# EAGLE schematic hydrogen_sensors_board_v2 (EAGLE 8.4.1)
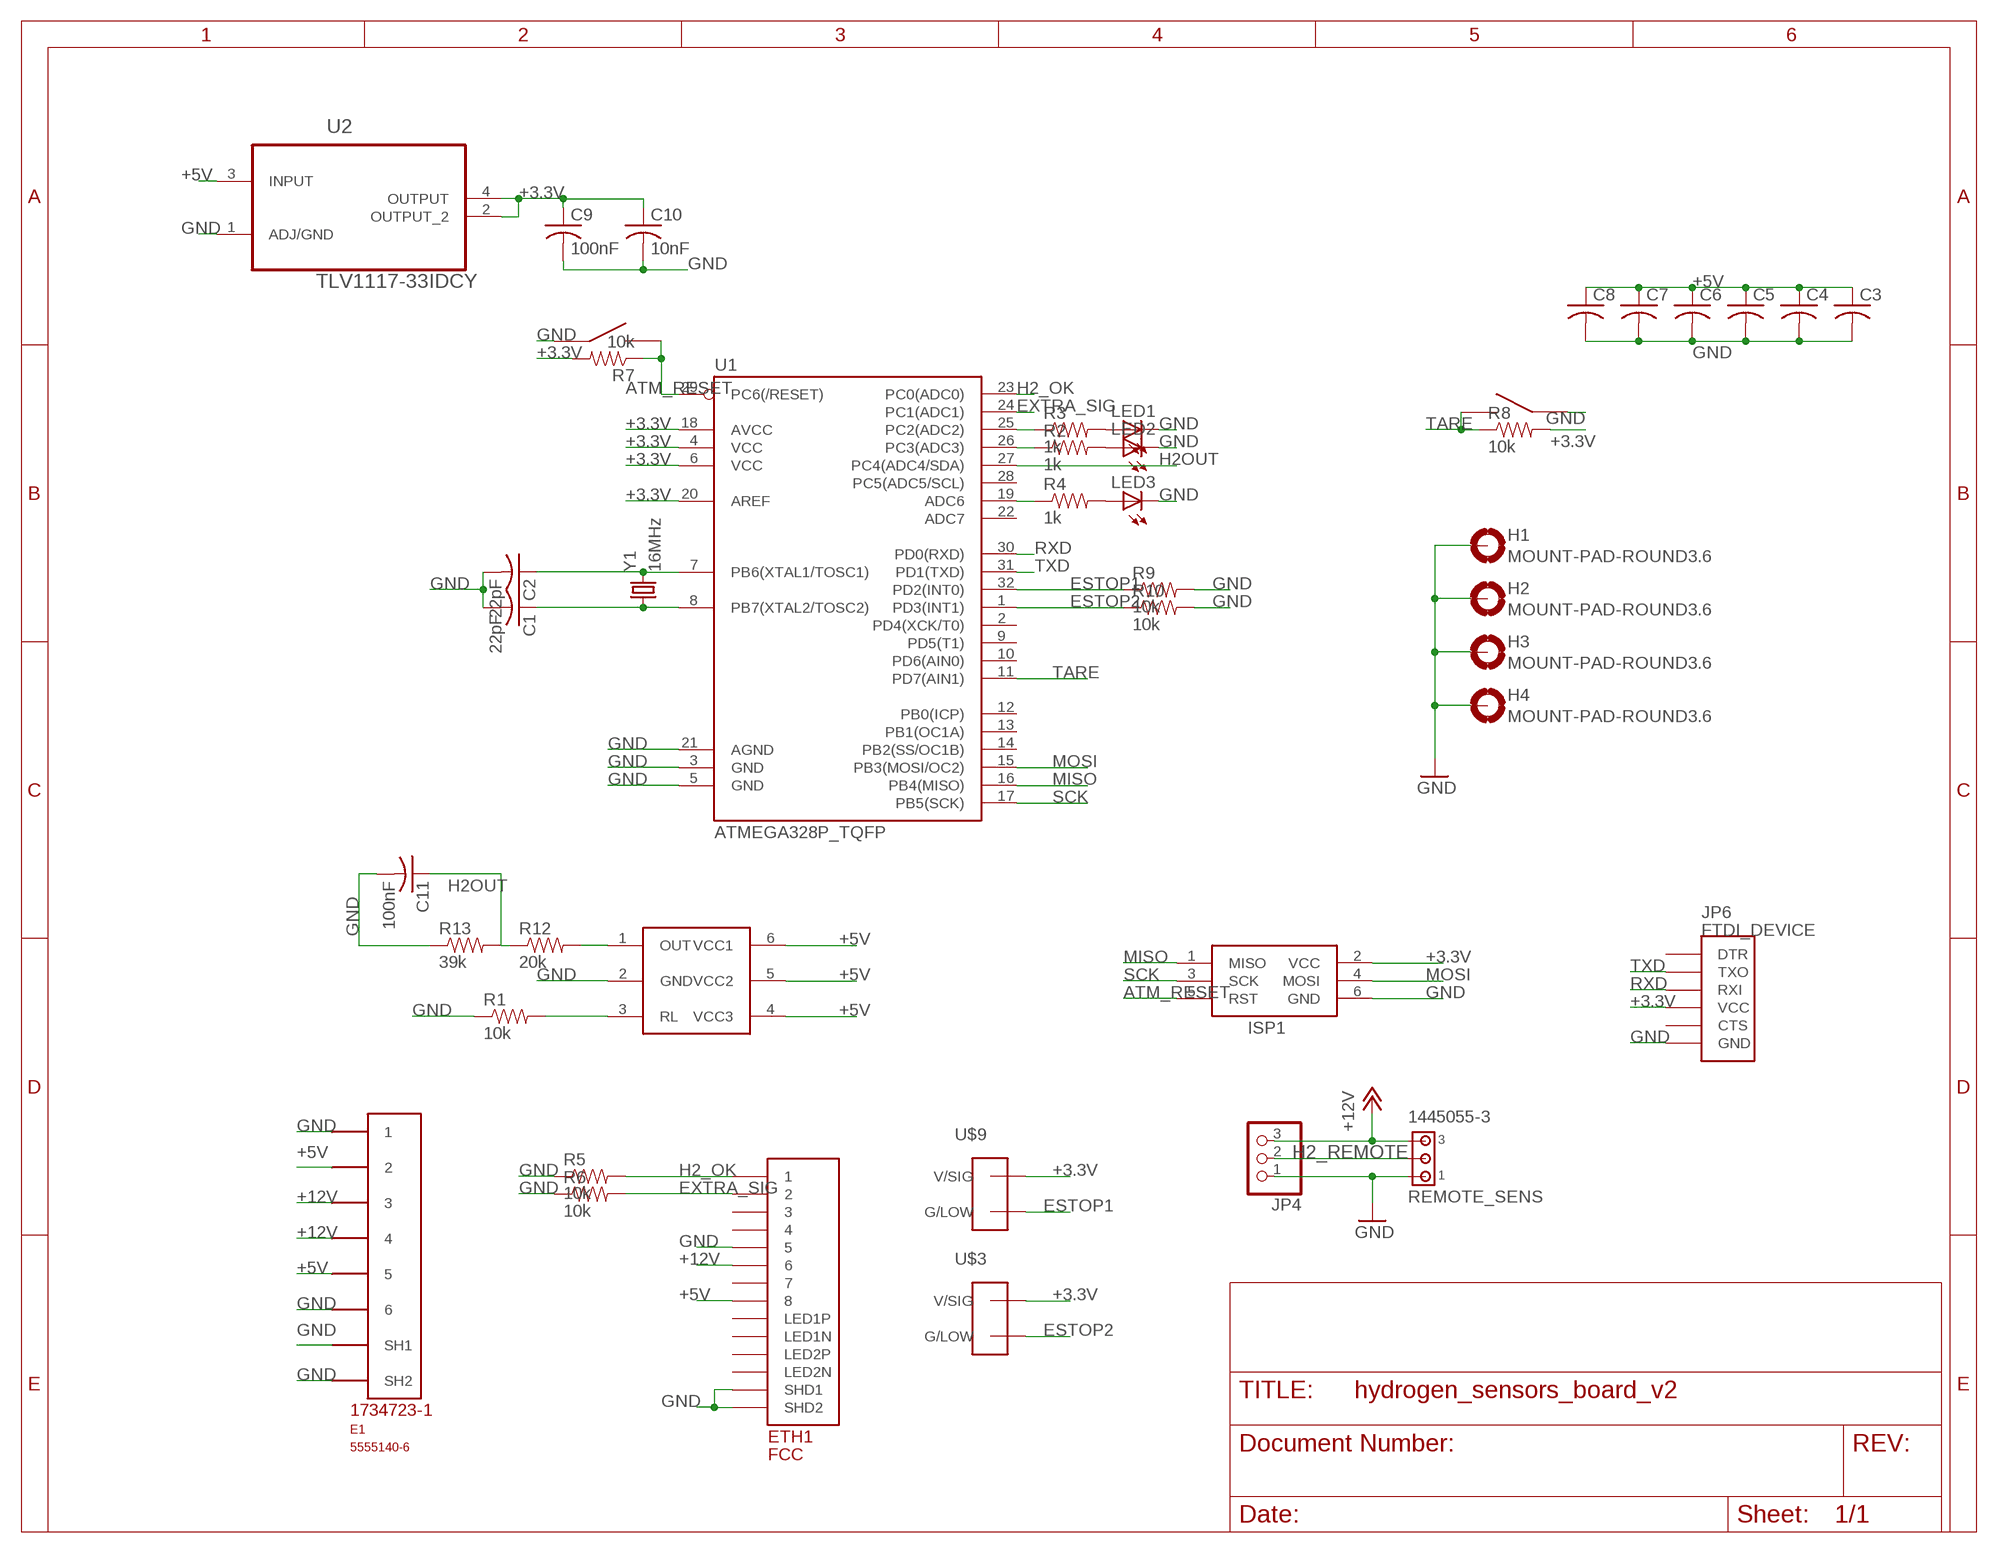
[diagram p0: schematic, sheet 1]

## Parts
C1  22pF  C-USC0603K  [C0603K]
C2  22pF  C-USC0603K  [C0603K]
C3  C-USC0603  [C0603]
C4  C-USC0603  [C0603]
C5  C-USC0603  [C0603]
C6  C-USC0603  [C0603]
C7  C-USC0603  [C0603]
C8  C-USC0603  [C0603]
C9  100nF  C-USC0603  [C0603]
C10  10nF  C-USC0603  [C0603]
C11  100nF  C-USC0603  [C0603]
E1  5555140-6  [1734723-1_RJ11]
ETH1  FCC  ETHERNET  [A122645-ND]
H1  MOUNT-PAD-ROUND3.6  [3,6-PAD]
H2  MOUNT-PAD-ROUND3.6  [3,6-PAD]
H3  MOUNT-PAD-ROUND3.6  [3,6-PAD]
H4  MOUNT-PAD-ROUND3.6  [3,6-PAD]
ISP1  AVRISP-BOX  [AVRISP-BOX]
JP4  PINHD-1X3  [1X03]
JP6  FTDI_DEVICE  [FTDI_DEVICE_SIDE]
LED1  LEDCHIPLED_0805  [CHIPLED_0805]
LED2  LEDCHIPLED_0805  [CHIPLED_0805]
LED3  LEDCHIPLED_0805  [CHIPLED_0805]
R1  10k  RESISTOR0603-RES  [0603-RES]
R2  1k  RESISTOR0603-RES  [0603-RES]
R3  1k  RESISTOR0603-RES  [0603-RES]
R4  1k  RESISTOR0603-RES  [0603-RES]
R5  10k  RESISTOR0603-RES  [0603-RES]
R6  10k  RESISTOR0603-RES  [0603-RES]
R7  10k  RESISTOR0603-RES  [0603-RES]
R8  10k  RESISTOR0603-RES  [0603-RES]
R9  10k  RESISTOR0603-RES  [0603-RES]
R10  10k  RESISTOR0603-RES  [0603-RES]
R12  20k  RESISTOR0603-RES  [0603-RES]
R13  39k  RESISTOR0603-RES  [0603-RES]
REMOTE_SENS  1445055-3  [1445055-3]
U1  ATMEGA328P_TQFP  [TQFP32-08]
U2  TLV1117-33IDCY  [SOT230P700X180-4N]
U$1  MQ-8MQ-8  [MQ-8]
U$2  EG4621CT-ND  [EG4621CT-ND]
U$3  TE770966  [2X1-MATE-N-LOCK]
U$9  TE770966  [2X1-MATE-N-LOCK]
U$10  EG4621CT-ND  [EG4621CT-ND]
Y1  16MHz  CRYSTALHC49US  [HC49US]

## Nets
+3.3V: C9.1 C10.1 ISP1.2(VCC) JP6.P$4(VCC) R7.2 R8.2 U1.4(VCC) U1.6(VCC) U1.18(AVCC) U1.20(AREF) U2.2(OUTPUT_2) U2.4(OUTPUT) U$3.CIRCUIT1(V/SIG) U$9.CIRCUIT1(V/SIG)
+5V: C3.1 C4.1 C5.1 C6.1 C7.1 C8.1 E1.2 E1.5 ETH1.P$8 U2.3(INPUT) U$1.4(VCC3) U$1.5(VCC2) U$1.6(VCC1)
+12V: E1.3 E1.4 ETH1.P$6 JP4.3 REMOTE_SENS.3
ATM_RESET: ISP1.5(RST) R7.1 U1.29(PC6(/RESET)) U$10.P$3 U$10.P$4
ESTOP1: R9.1 U1.32(PD2(INT0)) U$9.CIRCUIT2(G/LOW)
ESTOP2: R10.1 U1.1(PD3(INT1)) U$3.CIRCUIT2(G/LOW)
EXTRA_SIG: ETH1.P$2 R6.2 U1.24(PC1(ADC1))
GND: C1.2 C2.2 C3.2 C4.2 C5.2 C6.2 C7.2 C8.2 C9.2 C10.2 C11.2 E1.1 E1.6 E1.SH1 E1.SH2 ETH1.P$5 ETH1.P$13(SHD1) ETH1.P$14(SHD2) H1.B3,6(MOUNT) H2.B3,6(MOUNT) H3.B3,6(MOUNT) H4.B3,6(MOUNT) ISP1.6(GND) JP4.1 JP6.P$6(GND) LED1.C LED2.C LED3.C R1.1 R5.1 R6.1 R9.2 R10.2 R13.1 REMOTE_SENS.1 U1.3(GND) U1.5(GND) U1.21(AGND) U2.1(ADJ/GND) U$1.2(GND) U$2.P$1 U$2.P$2 U$10.P$1 U$10.P$2
H2_OK: ETH1.P$1 R5.2 U1.23(PC0(ADC0))
H2_REMOTE: JP4.2 REMOTE_SENS.2
H2OUT: C11.1 R12.1 R13.2 U1.27(PC4(ADC4/SDA))
MISO: ISP1.1(MISO) U1.16(PB4(MISO))
MOSI: ISP1.4(MOSI) U1.15(PB3(MOSI/OC2))
N$1: C2.1 U1.7(PB6(XTAL1/TOSC1)) Y1.2
N$2: R1.2 U$1.3(RL)
N$3: C1.1 U1.8(PB7(XTAL2/TOSC2)) Y1.1
N$4: R3.1 U1.25(PC2(ADC2))
N$5: R2.1 U1.26(PC3(ADC3))
N$6: R4.1 U1.19(ADC6)
N$7: LED1.A R3.2
N$8: LED2.A R2.2
N$9: LED3.A R4.2
N$10: R12.2 U$1.1(OUT)
RXD: JP6.P$3(RXI) U1.30(PD0(RXD))
SCK: ISP1.3(SCK) U1.17(PB5(SCK))
TARE: R8.1 U1.11(PD7(AIN1)) U$2.P$3 U$2.P$4
TXD: JP6.P$2(TXO) U1.31(PD1(TXD))
Unconnected: ETH1.P$3 ETH1.P$4 ETH1.P$7 ETH1.P$9(LED1N) ETH1.P$10(LED1P) ETH1.P$11(LED2N) ETH1.P$12(LED2P) JP6.P$1(DTR) JP6.P$5(CTS) U1.2(PD4(XCK/T0)) U1.9(PD5(T1)) U1.10(PD6(AIN0)) U1.12(PB0(ICP)) U1.13(PB1(OC1A)) U1.14(PB2(SS/OC1B)) U1.22(ADC7) U1.28(PC5(ADC5/SCL))

## Library data of the parts
C1-C11 = adafruit:C-US: CAPACITOR, American symbol
E1 = 5555140-6 RJ11:5555140-6
ETH1 = ETHERNET:ETHERNET: Ethernet port with 2 leds. digikey number A122645-ND
H1-H4 = holes:MOUNT-PAD-ROUND: MOUNTING PAD, round
ISP1 = adafruit:AVRISP: AVR ISP HEADER Standard 6 pin header for AVR programming
JP4 = pinhead:PINHD-1X3: PIN HEADER
JP6 = SparkFun-Connectors:FTDI_DEVICE: Connector which mates to FTDI basic or FTDI cable.
LED1-LED3 = adafruit:LED: LED OSRAM: - CHIPLED LG R971, LG N971, LY N971, LG Q971, LY Q971, LO R971, LY R971 LH N974, LH R974 LS Q976, LO Q976, LY Q976 LO Q996 - Hyper CHIPLED LW Q18S LB Q993, LB Q99A, LB R99A - SideLED LS A670, LO A670, LY A670, LG A670, LP A670 LB A673, LV A673, LT A673, LW A673 LH A674 LY A675 LS A676, LA A676, LO A676, LY A676, LW A676 LS A679, LY A679, LG A679 - Hyper Micro SIDELED® LS Y876, LA Y876, LO Y876, LY Y876 LT Y87S - SmartLED LW L88C, LW L88S LB L89C, LB L89S, LG L890 LS L89K, LO L89K, LY L89K LS L896, LA L896, LO L896, LY L896 - TOPLED LS T670, LO T670, LY T670, LG T670, LP T670 LSG T670, LSP T670, LSY T670, LOP T670, LYG T670 LG T671, LOG T671, LSG T671 LB T673, LV T673, LT T673, LW T673 LH T674 LS T676, LA T676, LO T676, LY T676, LB T676, LH T676, LSB T676, LW T676 LB T67C, LV T67C, LT T67C, LS T67K, LO T67K, LY T67K, LW E67C LS E67B, LA E67B, LO E67B, LY E67B, LB E67C, LV E67C, LT E67C LW T67C LS T679, LY T679, LG T679 LS T770, LO T770, LY T770, LG T770, LP T770 LB T773, LV T773, LT T773, LW T773 LH T774 LS E675, LA E675, LY E675, LS T675 LS T776, LA T776, LO T776, LY T776, LB T776 LHGB T686 LT T68C, LB T68C - Hyper Mini TOPLED® LB M676 - Mini TOPLED Santana® LG M470 LS M47K, LO M47K, LY M47K Source: http://www.osram.convergy.de/
R1 R5 R6 R9 R10 R12 R13 = SparkFun-Passives:RESISTOR: Resistor Basic schematic elements and footprints for 0603, 1206, and PTH resistors.
R2-R4 R7 R8 = SparkFun-Resistors:RESISTOR: Resistor Basic schematic elements and footprints for 0603, 1206, and PTH resistors.
REMOTE_SENS = con-amp:1445055-3: Micro MATE-N-LOK Connectors grid 1.5 mm Source: ENG_CD_1445055_A.pdf
U1 = SparkFun-DigitalIC:ATMEGA328P_TQFP; PROD_ID: IC-09069
U2 = Texas Instruments_By_element14_Batch_1:TLV1117-33IDCY: V REG, LDO, 3.3V, 0.8A; MPN: TLV1117-33IDCY; OC_FARNELL: 1703385; OC_NEWARK: 67K8522; PACKAGE: SOT-223-3; SUPPLIER: TEXAS INSTRUMENTS
U$1 = donny_library:MQ-8
U$2 U$10 = EG4621CT-ND:EG4621CT-ND: surface mount push putton digikey number EG4621CT-ND
U$3 U$9 = Shell2013:TE770966
Y1 = SparkFun-FreqCtrl:CRYSTAL: Various standard crystals. Proven footprints.